# Altium schematic sheet pren-et_DC.SchDoc: Power
size A3; DrawnBy: Flavio Kreiliger & Ervin Mazlagic; Organization: HSLU T&A; Address1: Abteilung Elektrotechnik; Address2: Technikumsstrasse 21; Address3: CH-6048 Horw; SheetNumber: 1; Projektname: pren-et DC
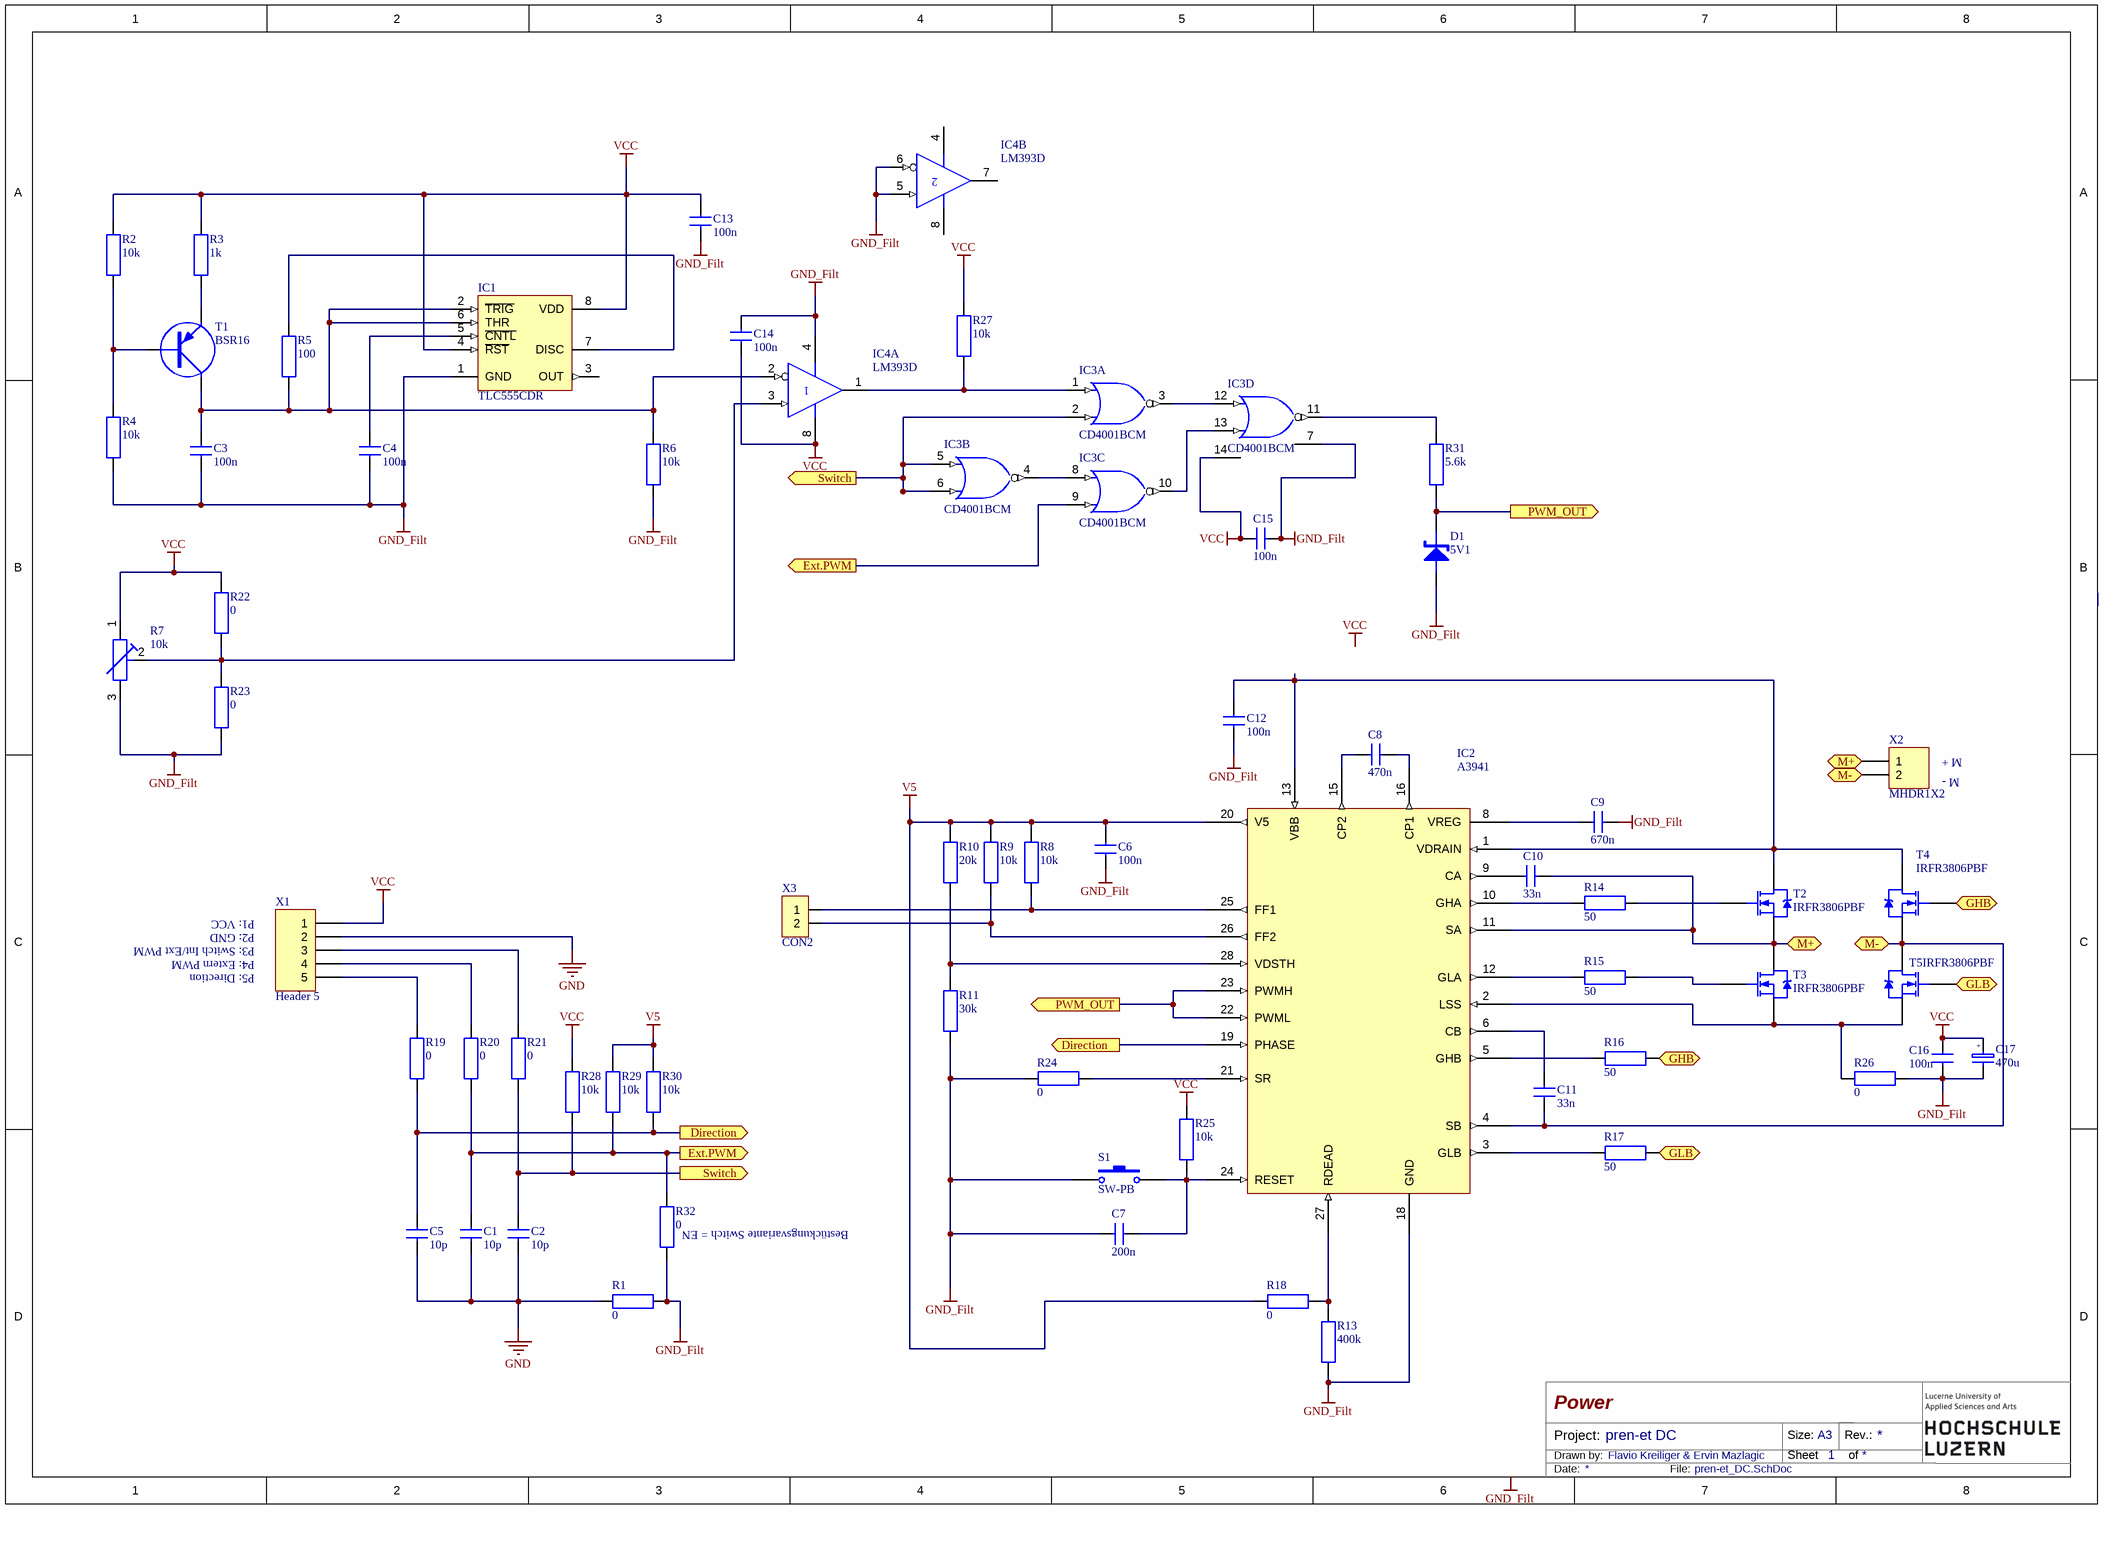
[diagram p0: pren-et_DC.SchDoc]

## Parts
C1  10p  [0805]
C2  10p  [0805]
C3  100n  [0805]
C4  100n  [0805]
C5  10p  [0805]
C6  100n  [0805]
C7  200n  [0805]
C8  470n  [0805]
C9  670n  [0805]
C10  33n  [0805]
C11  33n  [0805]
C12  100n  [0805]
C13  100n  [0805]
C14  100n  [0805]
C15  100n  [0805]
C16  100n  [0805]
C17  470u  [EEEFP1E471AP Elko]
D1  5V1
IC1  TLC555CDR  [D008_N]
IC2  A3941  [A3941]
IC3  CD4001BCM  [M14A_M]  (parts A,B,C,D of 4)
IC4  LM393D  [D008_N]  (parts A,B of 2)
R1  0  [0805]
R2  10k  [0805]
R3  1k  [0805]
R4  10k  [0805]
R5  100  [0805]
R6  10k  [0805]
R7  10k  [POT2]
R8  10k  [0805]
R9  10k  [0805]
R10  20k  [0805]
R11  30k  [0805]
R13  400k  [0805]
R14  50  [0805]
R15  50  [0805]
R16  50  [0805]
R17  50  [0805]
R18  0  [0805]
R19  0  [0805]
R20  0  [0805]
R21  0  [0805]
R22  0  [0805]
R23  0  [0805]
R24  0  [0805]
R25  10k  [0805]
R26  0  [0805]
R27  10k  [0805]
R28  10k  [0805]
R29  10k  [0805]
R30  10k  [0805]
R31  5.6k  [0805]
R32  0  [0805]
S1  SW-PB  [SW_JB15FBP2]
T1  BSR16  [BSR16]
T2  IRFR3806PBF  [TO-252AA_N]
T3  IRFR3806PBF  [TO-252AA_N]
T4  IRFR3806PBF  [TO-252AA_N]
T5  IRFR3806PBF  [TO-252AA_N]
X1  Header 5  [connector 5 Pin]
X2  MHDR1X2  [Connector 2 Pin]
X3  CON2  [Testpoint 2 Pin]

## Ports
Direction (out), Ext.PWM (out), GHB (in), GHB (out), GLB (in), GLB (out), M+, M-, PWM_OUT (out), Switch (out)

## Nets
8: IC2.7(VREG)
GND: C1.2 C2.2 C5.2 IC3.7(GND) R1.1 X1.2
GND_Filt: C3.2 C4.2 C6.2 C7.1 C9.2 C12.1 C13.1 C14.2 C15.1 C16.1 C17.K D1.A IC1.1(GND) IC2.17(GND) IC2.18(GND) IC2.29(GND) IC3.7(GND) IC4.4(GND) IC4.5(IN+) IC4.6(IN-) R1.2 R4.1 R6.1 R7.3 R11.1 R13.1 R23.1 R24.2 R26.1 R32.1 S1.1
V5: C6.1 IC2.20(V5) R8.2 R9.2 R10.2 R18.1 R29.2 R30.2
VCC: C13.2 C14.1 C15.2 C16.2 C17.A IC1.4(~{RST}) IC1.8(VDD) IC2.14(VBB) IC3.14(VCC) IC4.8(VCC) R2.2 R3.2 R7.1 R22.2 R25.2 R27.2 R28.2 X1.1
VDD: IC3.14(VDD)
Direction: C5.1 IC2.19(PHASE) R19.1 R30.1 ; port Direction
Ext.PWM: C1.1 IC3.9(B) R20.1 R29.1 R32.2 ; port Ext.PWM
GHB: R16.2 T4.1(G) ; port GHB
GLB: R17.2 T5.1(G) ; port GLB
M+: C10.2 IC2.11(SA) T2.3(S) T3.4(D) X2.1 ; port M+
M-: C11.1 IC2.4(SB) T4.3(S) T5.4(D) X2.2 ; port M-
PWM_OUT: D1.K IC2.22(PWML) IC2.23(PWMH) R31.1 ; port PWM_OUT
Switch: C2.1 IC3.2(B) IC3.5(A) IC3.6(B) R21.1 R28.1 ; port Switch
NetC3_1: C3.1 IC1.2(~{TRIG}) IC1.6(THR) IC4.2(IN-) R5.1 R6.2 T1.C
NetC4_1: C4.1 IC1.5(~{CNTL})
NetC7_2: C7.2 IC2.24(RESET) R25.1 S1.2
NetC8_1: C8.1 IC2.15(CP2)
NetC8_2: C8.2 IC2.16(CP1)
NetC9_1: C9.1 IC2.8(VREG)
NetC10_1: C10.1 IC2.9(CA)
NetC11_2: C11.2 IC2.6(CB)
NetC12_2: C12.2 IC2.1(VDRAIN) IC2.13(VBB) T2.4(D) T4.4(D)
NetIC1_7: IC1.7(DISC) R5.2
NetIC2_2: IC2.2(LSS) R26.2 T3.3(S) T5.3(S)
NetIC2_3: IC2.3(GLB) R17.1
NetIC2_5: IC2.5(GHB) R16.1
NetIC2_10: IC2.10(GHA) R14.2
NetIC2_12: IC2.12(GLA) R15.2
NetIC2_21: IC2.21(SR) R24.1
NetIC2_25: IC2.25(FF1) R8.1 X3.1
NetIC2_26: IC2.26(FF2) R9.1 X3.2
NetIC2_27: IC2.27(RDEAD) R13.2 R18.2
NetIC2_28: IC2.28(VDSTH) R10.1 R11.2
NetIC3_1: IC3.1(A) IC4.1(OUT) R27.1
NetIC3_3: IC3.3(J) IC3.12(A)
NetIC3_4: IC3.4(J) IC3.8(A)
NetIC3_10: IC3.10(J) IC3.13(B)
NetIC3_11: IC3.11(J) R31.2
NetIC4_3: IC4.3(IN+) R7.2 R22.1 R23.2
NetR2_1: R2.1 R4.2 T1.B
NetR3_1: R3.1 T1.E
NetR14_1: R14.1 T2.1(G)
NetR15_1: R15.1 T3.1(G)
NetR19_2: R19.2 X1.5
NetR20_2: R20.2 X1.4
NetR21_2: R21.2 X1.3

Not connected (* = marked no-connect by the designer): IC1 3(OUT); IC4 7(OUT)

## Notes on the sheet
- (near X2) M -
- M +
- P1: VCC
- P2: GND
- P3: Switch Int/Ext PWM
- P4: Extern PWM
- P5: Direction
- (near R32) Bestückungsvariante Switch = EN
- Labels drawn without touching a wire or pin: GND_Filt, VCC
- Project:
- Drawn by:
- Size:
- Sheet
- A3
- Rev.:
- of
- Date:
- File:
- (in symbol C? ELKO) +

## Library data of the parts
C1-C16 = C?: Normaler Kondensator
C17 = C? ELKO: Elektrolyt /polarisierter Kondensator
D1 = ZENER2
IC1 = TLC555CDR: LinCMOS Timer; Published: 15-Apr-2002; LatestRevisionDate: 13-Apr-2006; LatestRevisionNote: IPC-7351 Footprint Added.; DatasheetVersion: Oct-1988; PackageVersion: Jan-1998; PackageReference: D008; Publisher: Altium Limited; PackageDescription: 8-Pin Small Outline Integrated Circuit 1.27 mm Pitch; Code_IPC: SOIC127P600-8; ComponentLink1Description: Manufacturer Link; ComponentLink1URL: http://www.ti.com/; ComponentLink2Description: Datasheet; ComponentLink2URL: http://www-s.ti.com/sc/ds/tlc555.pdf
IC2 = A3941: A3941 SOIC IC
IC3 = CD4001BCM: Quad 2-Input NOR Buffered B series Gate, 14-Pin SOIC; IC_Technology: C; Published: 17-Jul-2002; LatestRevisionDate: 13-Apr-2006; LatestRevisionNote: IPC-7351 Footprint Added.; DatasheetVersion: Jan-1999; PackageVersion: 2000; PackageReference: M14A; Publisher: Altium Limited; PackageDescription: 14-Pin Small Outline Integrated Circuit 1.27 mm Pitch; Code_IPC: SOIC127P600-14; ComponentLink1Description: Manufacturer Link; ComponentLink1URL: http://www.fairchildsemi.com/; ComponentLink2Description: Datasheet; ComponentLink2URL: http://www.fairchildsemi.com/ds/CD%2FCD4001BC.pdf
IC4 = LM393D: Dual Differential Comparator; Published: 15-Apr-2002; LatestRevisionDate: 13-Apr-2006; LatestRevisionNote: IPC-7351 Footprint Added.; DatasheetVersion: Nov-1988; PackageVersion: Jan-1998; PackageReference: D008; Publisher: Altium Limited; PackageDescription: 8-Pin Small Outline Integrated Circuit 1.27 mm Pitch; Code_IPC: SOIC127P600-8; ComponentLink1Description: Manufacturer Link; ComponentLink1URL: http://www.ti.com/; ComponentLink2Description: Datasheet; ComponentLink2URL: http://www-s.ti.com/sc/ds/lm193.pdf
R1-R6 R8-R11 R13-R32 = R?: Normaler Widerstand
R7 = R_POT1
S1 = SW-PB: Switch; Published: 24-Mar-1999; LatestRevisionDate: 17-Jul-2002; LatestRevisionNote: Re-released for DXP Platform.; PackageReference: SPST-2; Publisher: Altium Limited; PackageDescription: Switch; 2 Leads
T1 = PNP
T2-T5 = IRFR014: N-Channel Power MOSFET; Note: Pin 2 is trimmed and is electrically connected to Drain.; Published: 8-Jun-2000; LatestRevisionDate: 20-Nov-2009; LatestRevisionNote: IPC-7351 Footprint Added.; DatasheetVersion: PD-9.7014; PackageVersion: Feb-2003; PackageReference: TO-252AA; Publisher: Altium Limited; PackageDescription: 3-Pin HEXFET Package 2.28 mm Pitch, 9.9 mm Lead Span; Code_JEDEC: TO-252-AA; ComponentLink1Description: Manufacturer Link; ComponentLink1URL: http://www.irf.com/; ComponentLink2Description: Datasheet; ComponentLink2URL: http://www.irf.com/product-info/datasheets/data/irfr014.pdf
X1 = Header 5: Header, 5-Pin; LatestRevisionDate: 17-Jul-2002; LatestRevisionNote: Re-released for DXP Platform.; Publisher: Altium Limited
X2 = MHDR1X2: Header, 2-Pin; LatestRevisionDate: 17-Jul-2002; LatestRevisionNote: Re-released for DXP Platform.; Publisher: Altium Limited